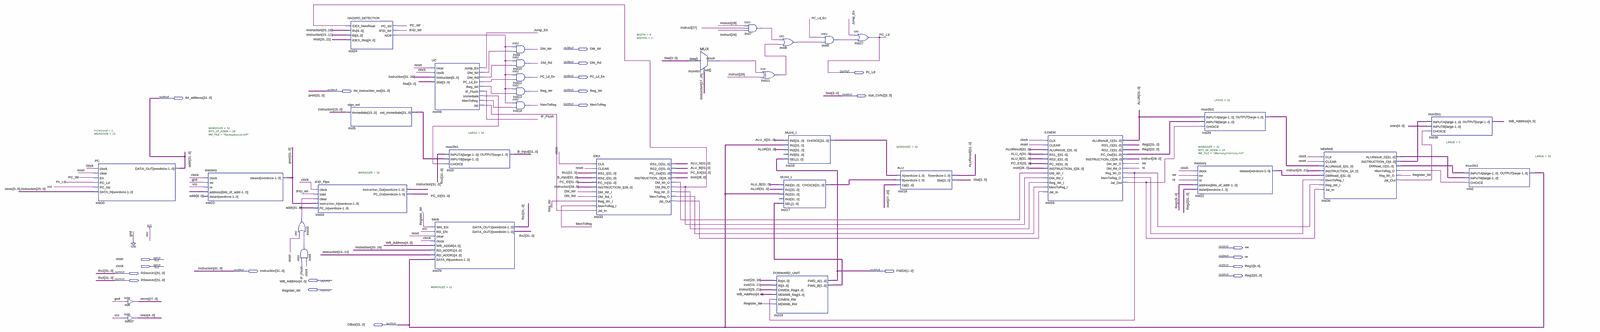
[diagram p0: schematic sheet, whole]
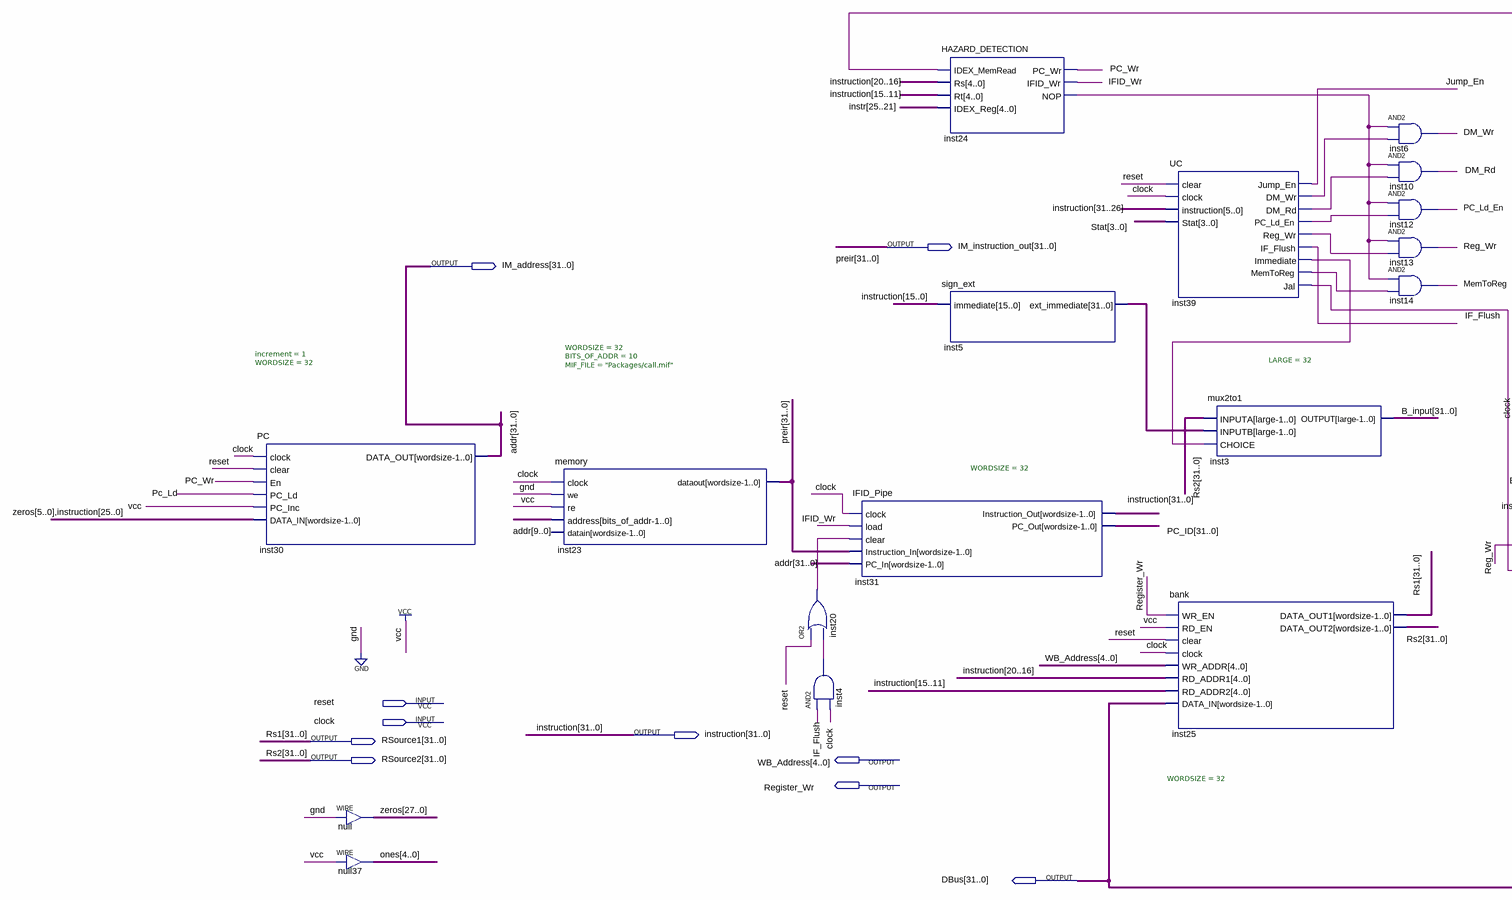
[diagram p1: schematic sheet, left part]
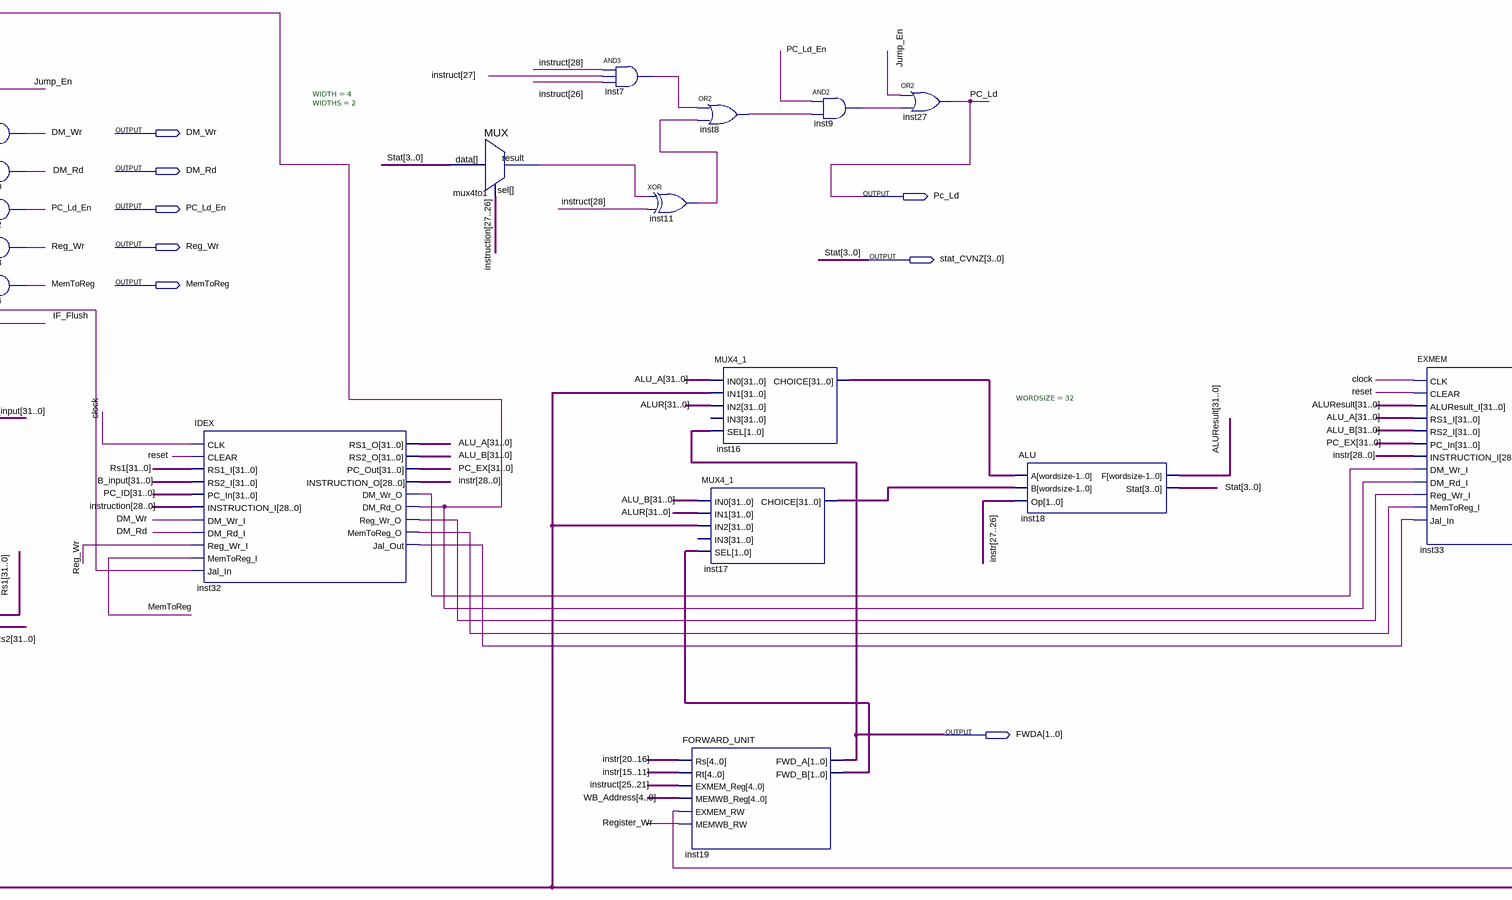
[diagram p2: schematic sheet, centre part]
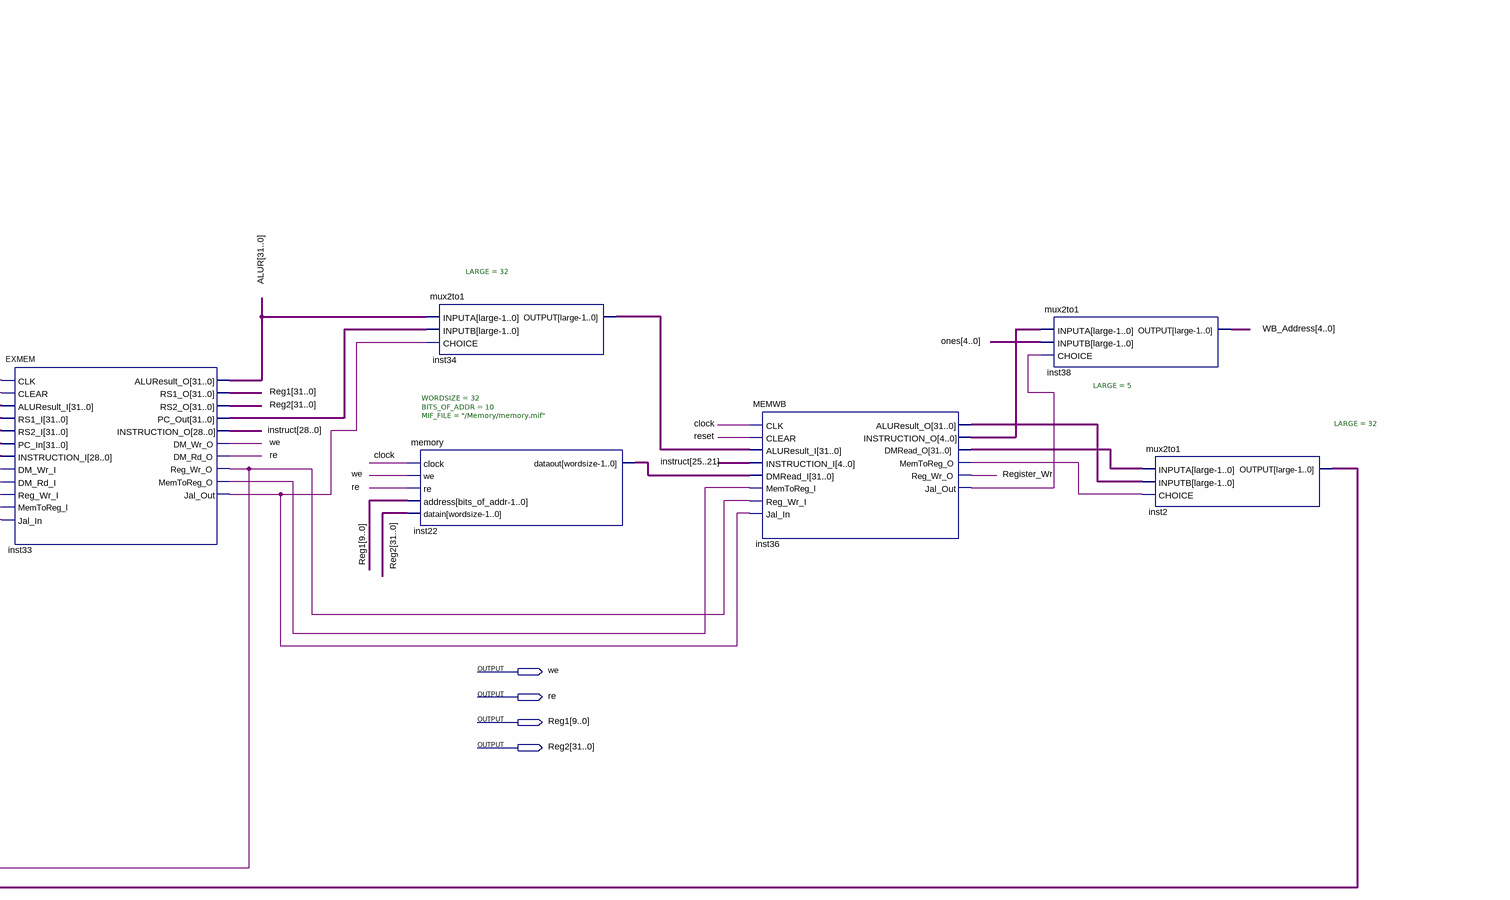
[diagram p3: schematic sheet, right part]
// Quartus schematic processor.bdf as structural Verilog: 34 symbols, 22 pins
module processor (
  input  reset,
  input  clock,
  output DM_Wr,
  output DM_Rd,
  output Pc_Ld,
  output PC_Ld_En,
  output [31:0] IM_instruction_out,
  output Reg_Wr,
  output [3:0] stat_CVNZ,
  output [31:0] IM_address,
  output MemToReg,
  output we,
  output re,
  output [31:0] Reg1,
  output [31:0] instruction,
  output [1:0] FWDA,
  output [31:0] RSource1,
  output [31:0] Reg2,
  output [31:0] RSource2,
  output [4:0] WB_Address,
  output Register_Wr,
  output [31:0] DBus
);

  wire IF_Flush, IFID_Wr, inst4_out, inst7_out, inst8_out, inst9_out, inst11_out, inst20_out, inst24_nop,
       inst32_dm_rd_o, inst32_dm_wr_o, inst32_jal_out, inst32_memtoreg_o, inst32_reg_wr_o, inst33_jal_out,
       inst33_memtoreg_o, inst33_reg_wr_o, inst36_jal_out, inst36_memtoreg_o, inst39_dm_rd, inst39_dm_wr,
       inst39_immediate, inst39_jal, inst39_memtoreg, inst39_pc_ld_en, inst39_reg_wr, Jump_En,
       mux4to1_result, PC_Wr;
  wire [1:0] inst19_fwd_b;
  wire [4:0] inst36_instruction_o, ones;
  wire [27:0] zeros;
  wire [28:0] instr, instruct;
  wire [31:0] ALU_A, ALU_B, ALUR, ALUResult, B_input, inst5_ext_immediate, inst16_choice, inst17_choice,
       inst22_dataout, inst33_pc_out, inst34_output, inst36_aluresult_o, inst36_dmread_o, PC_EX, PC_ID;

  PC #(.increment(1), .WORDSIZE(32)) inst30 (
    .clock(clock), .clear(reset), .En(PC_Wr), .PC_Ld(Pc_Ld), .PC_Inc(1'b1),
    .DATA_IN({zeros[5:0], instruction[25:0]}), .DATA_OUT(IM_address));
  assign zeros = {28{1'b0}};  // WIRE null
  assign ones = {5{1'b1}};  // WIRE null37
  memory #(.WORDSIZE(32), .BITS_OF_ADDR(10), .MIF_FILE("Packages/call.mif")) inst23 (
    .clock(clock), .we(1'b0), .re(1'b1), .address(IM_address[9:0]), .dataout(IM_instruction_out));  // open: datain
  or inst20 (inst20_out, reset, inst4_out);
  and inst4 (inst4_out, IF_Flush, clock);
  IFID_Pipe #(.WORDSIZE(32)) inst31 (
    .clock(clock), .load(IFID_Wr), .clear(inst20_out), .Instruction_In(IM_instruction_out),
    .PC_In(IM_address), .Instruction_Out(instruction), .PC_Out(PC_ID));
  HAZARD_DETECTION inst24 (
    .IDEX_MemRead(inst32_dm_rd_o), .Rs(instruction[20:16]), .Rt(instruction[15:11]), .IDEX_Reg(instr[25:21]),
    .PC_Wr(PC_Wr), .IFID_Wr(IFID_Wr), .NOP(inst24_nop));
  sign_ext inst5 (.immediate(instruction[15:0]), .ext_immediate(inst5_ext_immediate));
  UC inst39 (
    .clear(reset), .clock(clock), .instruction(instruction[31:26]), .Stat(stat_CVNZ), .Jump_En(Jump_En),
    .DM_Wr(inst39_dm_wr), .DM_Rd(inst39_dm_rd), .PC_Ld_En(inst39_pc_ld_en), .Reg_Wr(inst39_reg_wr),
    .IF_Flush(IF_Flush), .Immediate(inst39_immediate), .MemToReg(inst39_memtoreg), .Jal(inst39_jal));
  bank #(.WORDSIZE(32)) inst25 (
    .WR_EN(Register_Wr), .RD_EN(1'b1), .clear(reset), .clock(clock), .WR_ADDR(WB_Address),
    .RD_ADDR1(instruction[20:16]), .RD_ADDR2(instruction[15:11]), .DATA_IN(DBus), .DATA_OUT1(RSource1),
    .DATA_OUT2(RSource2));
  mux2to1 #(.LARGE(32)) inst3 (
    .INPUTA(RSource2), .INPUTB(inst5_ext_immediate), .CHOICE(inst39_immediate), .OUTPUT(B_input));
  and inst6 (DM_Wr, inst24_nop, inst39_dm_wr);
  and inst10 (DM_Rd, inst24_nop, inst39_dm_rd);
  and inst12 (PC_Ld_En, inst24_nop, inst39_pc_ld_en);
  and inst13 (Reg_Wr, inst24_nop, inst39_reg_wr);
  and inst14 (MemToReg, inst24_nop, inst39_memtoreg);
  IDEX inst32 (
    .CLK(clock), .CLEAR(reset), .RS1_I(RSource1), .RS2_I(B_input), .PC_In(PC_ID),
    .INSTRUCTION_I(instruction[28:0]), .DM_Wr_I(DM_Wr), .DM_Rd_I(DM_Rd), .Reg_Wr_I(Reg_Wr),
    .MemToReg_I(MemToReg), .Jal_In(inst39_jal), .RS1_O(ALU_A), .RS2_O(ALU_B), .PC_Out(PC_EX),
    .INSTRUCTION_O(instr), .DM_Wr_O(inst32_dm_wr_o), .DM_Rd_O(inst32_dm_rd_o), .Reg_Wr_O(inst32_reg_wr_o),
    .MemToReg_O(inst32_memtoreg_o), .Jal_Out(inst32_jal_out));
  MUX #(.WIDTH(4), .WIDTHS(2)) mux4to1 (.data(stat_CVNZ), .sel(instruction[27:26]), .result(mux4to1_result));
  and inst7 (inst7_out, instruct[28], instruct[27], instruct[26]);
  xor inst11 (inst11_out, mux4to1_result, instruct[28]);
  FORWARD_UNIT inst19 (
    .Rs(instr[20:16]), .Rt(instr[15:11]), .EXMEM_Reg(instruct[25:21]), .MEMWB_Reg(WB_Address),
    .EXMEM_RW(inst33_reg_wr_o), .MEMWB_RW(Register_Wr), .FWD_A(FWDA), .FWD_B(inst19_fwd_b));
  or inst8 (inst8_out, inst7_out, inst11_out);
  MUX4_1 inst16 (.IN0(ALU_A), .IN1(DBus), .IN2(ALUR), .SEL(FWDA), .CHOICE(inst16_choice));  // open: IN3
  MUX4_1 inst17 (.IN0(ALU_B), .IN1(ALUR), .IN2(DBus), .SEL(inst19_fwd_b), .CHOICE(inst17_choice));  // open: IN3
  and inst9 (inst9_out, PC_Ld_En, inst8_out);
  or inst27 (Pc_Ld, Jump_En, inst9_out);
  ALU #(.WORDSIZE(32)) inst18 (
    .A(inst16_choice), .B(inst17_choice), .Op(instr[27:26]), .F(ALUResult), .Stat(stat_CVNZ));
  EXMEM inst33 (
    .CLK(clock), .CLEAR(reset), .ALUResult_I(ALUResult), .RS1_I(ALU_A), .RS2_I(ALU_B), .PC_In(PC_EX),
    .INSTRUCTION_I(instr), .DM_Wr_I(inst32_dm_wr_o), .DM_Rd_I(inst32_dm_rd_o), .Reg_Wr_I(inst32_reg_wr_o),
    .MemToReg_I(inst32_memtoreg_o), .Jal_In(inst32_jal_out), .ALUResult_O(ALUR), .RS1_O(Reg1), .RS2_O(Reg2),
    .PC_Out(inst33_pc_out), .INSTRUCTION_O(instruct), .DM_Wr_O(we), .DM_Rd_O(re), .Reg_Wr_O(inst33_reg_wr_o),
    .MemToReg_O(inst33_memtoreg_o), .Jal_Out(inst33_jal_out));
  mux2to1 #(.LARGE(32)) inst34 (.INPUTA(ALUR), .INPUTB(inst33_pc_out), .CHOICE(inst33_jal_out), .OUTPUT(inst34_output));
  memory #(.WORDSIZE(32), .BITS_OF_ADDR(10), .MIF_FILE("/Memory/memory.mif")) inst22 (
    .clock(clock), .we(we), .re(re), .address(Reg1[9:0]), .datain(Reg2), .dataout(inst22_dataout));
  MEMWB inst36 (
    .CLK(clock), .CLEAR(reset), .ALUResult_I(inst34_output), .INSTRUCTION_I(instruct[25:21]),
    .DMRead_I(inst22_dataout), .MemToReg_I(inst33_memtoreg_o), .Reg_Wr_I(inst33_reg_wr_o),
    .Jal_In(inst33_jal_out), .ALUResult_O(inst36_aluresult_o), .INSTRUCTION_O(inst36_instruction_o),
    .DMRead_O(inst36_dmread_o), .MemToReg_O(inst36_memtoreg_o), .Reg_Wr_O(Register_Wr),
    .Jal_Out(inst36_jal_out));
  mux2to1 #(.LARGE(5)) inst38 (
    .INPUTA(inst36_instruction_o), .INPUTB(ones), .CHOICE(inst36_jal_out), .OUTPUT(WB_Address));
  mux2to1 #(.LARGE(32)) inst2 (
    .INPUTA(inst36_dmread_o), .INPUTB(inst36_aluresult_o), .CHOICE(inst36_memtoreg_o), .OUTPUT(DBus));

  // Other names for the same wires on the sheet: addr[31:0] = IM_address; preir[31:0] = IM_instruction_out;
  //   Rs1[31:0] = RSource1; Rs2[31:0] = RSource2; Stat[3:0] = stat_CVNZ
endmodule
